# Altium schematic sheet OMD_F3_MCU.SchDoc
size A2; Organization: Altium Limited; Address1: L3, 12a Rodborough Rd; Address2: Frenchs Forest; Address3: NSW; Address4: Australia 2086
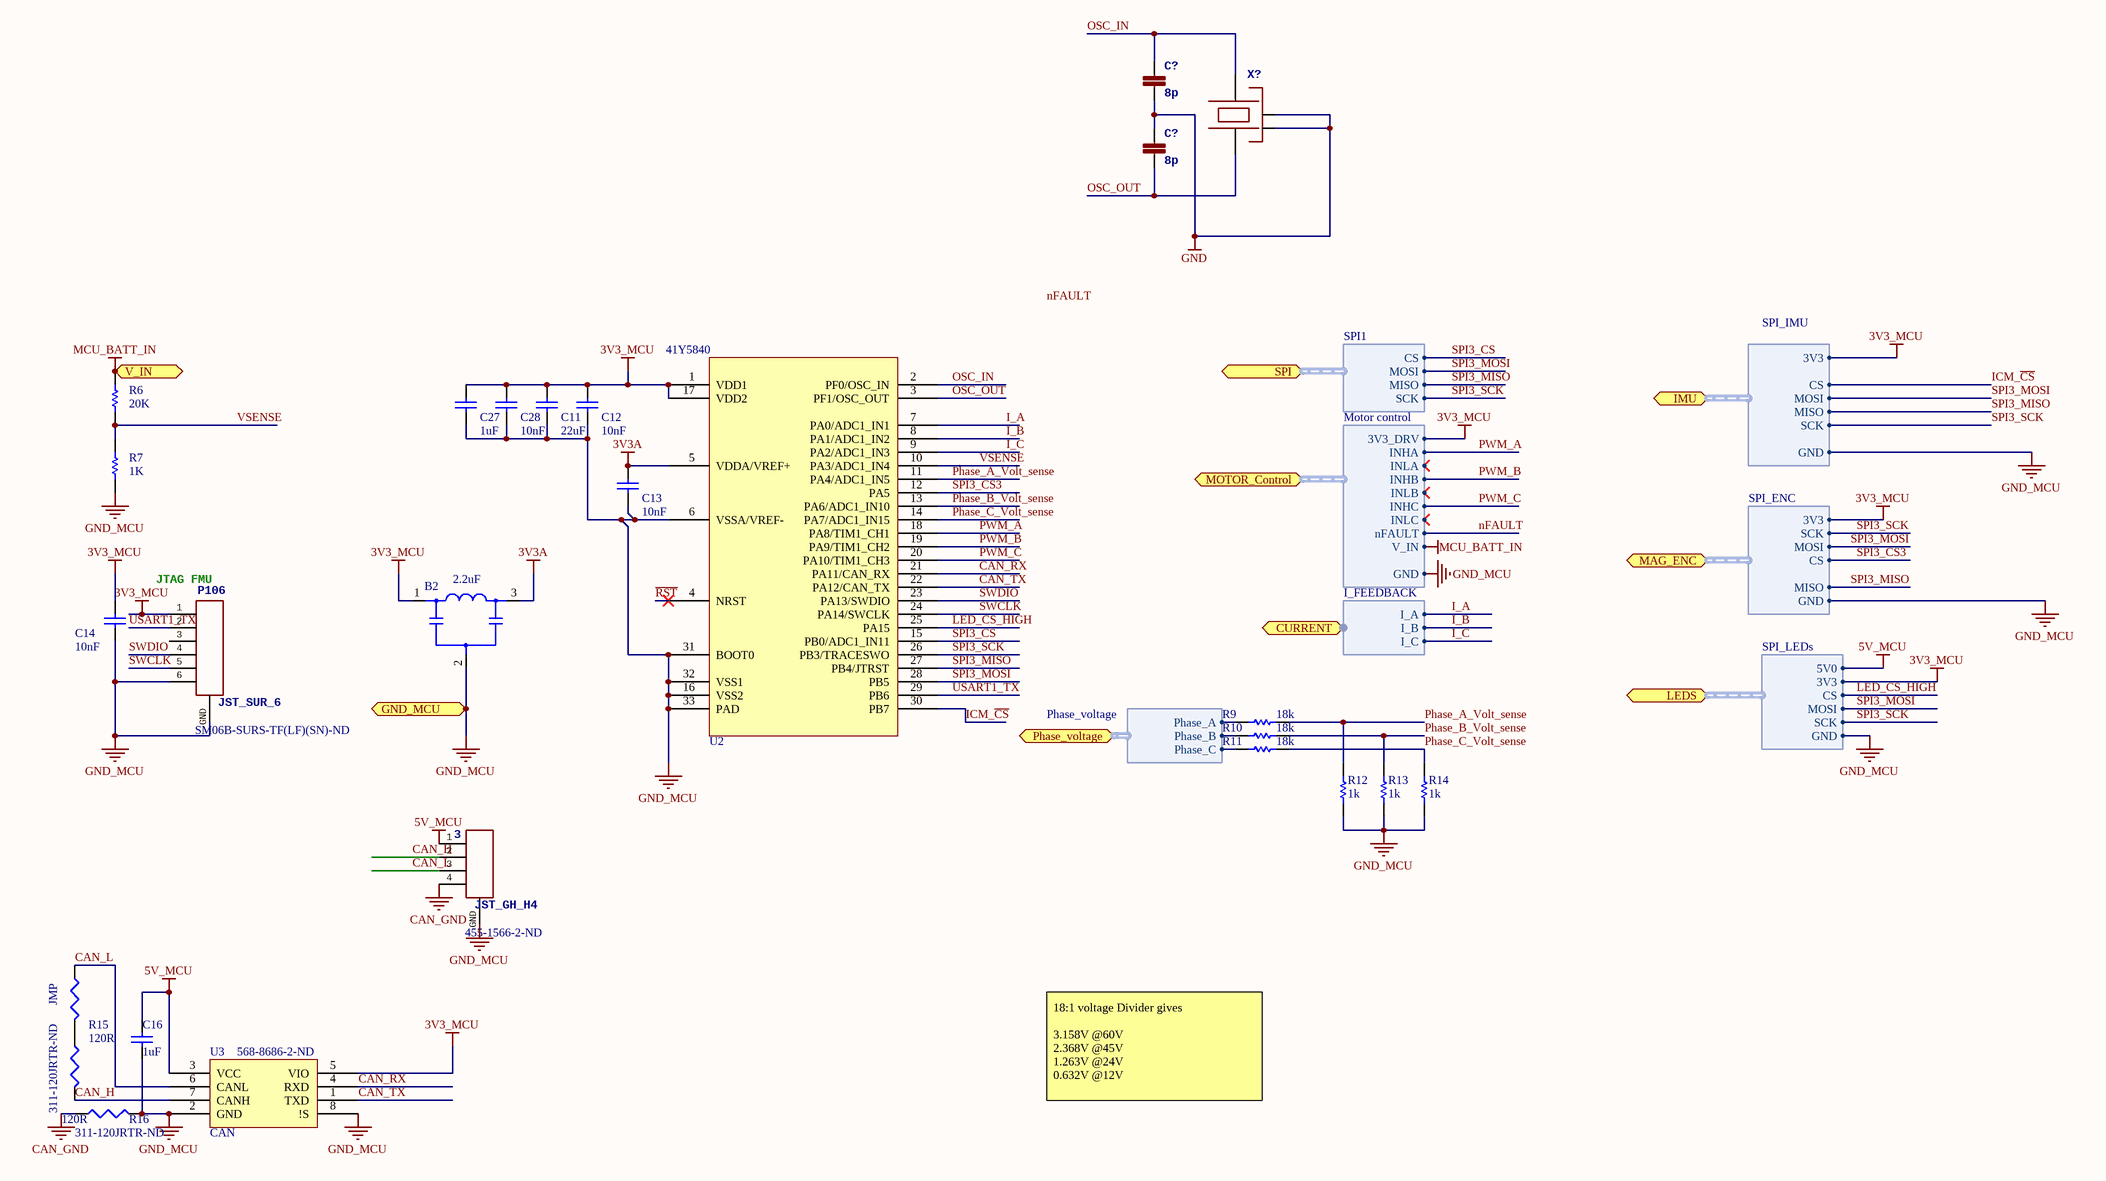
[diagram p0: OMD_F3_MCU.SchDoc]

## Parts
(Parts that share a designator on the sheet are numbered #1, #2 ... from top to bottom, then left to right.)
3  JST_GH_H4  Supplier Part Number 1: 455-1566-2-ND  [JST_GH_H4]
B2  value 2.2uF  [NFM18CC]  (hidden comment: Filter)
C11  value 22uF  [CAPC2012L]  (hidden comment: Cap)
C12  value 10nF  [CAPC1005L]  (hidden comment: CAP CER 10000PF 50V X7R 0402)
C13  value 10nF  [CAPC1005L]  (hidden comment: CAP CER 10000PF 50V X7R 0402)
C14  value 10nF  [CAPC1005L]  (hidden comment: CAP CER 10000PF 50V X7R 0402)
C16  value 1uF  [CAPC1005L]  (hidden comment: Cap)
C27  value 1uF  [CAPC1005L]  (hidden comment: Cap)
C28  value 10nF  [CAPC1005L]  (hidden comment: CAP CER 10000PF 50V X7R 0402)
C?#1  8p  [0201-cap]
C?#2  8p  [0201-cap]
JMP  solder  [R0402]  (value not drawn)  (no BOM)
P106  JST_SUR_6  Supplier Part Number 1: SM06B-SURS-TF(LF)(SN)-ND  [JST_SUR_H6]
R6  value 20K  [RESC1005L]  (hidden comment: CRCW040220K0FKED)
R7  value 1K  [RESC1005L]  (hidden comment: CRCW04021K00FKED)
R9  value 18k  [R0805]  (hidden comment: RES)
R10  value 18k  [R0805]  (hidden comment: RES)
R11  value 18k  [R0805]  (hidden comment: RES)
R12  value 1k  [R0805]  (hidden comment: RES)
R13  value 1k  [R0805]  (hidden comment: RES)
R14  value 1k  [R0805]  (hidden comment: RES)
R15  value 120R  Supplier Part Number 1: 311-120JRTR-ND  [R0402]  (hidden comment: RES SMD 120 OHM 5% 1/16W 0402)
R16  value 120R  Supplier Part Number 1: 311-120JRTR-ND  [R0402]  (hidden comment: RES SMD 120 OHM 5% 1/16W 0402)
U2  Supplier Part Number 1: 41Y5840  [QFN50P500X500X60-32L]  (hidden comment: IC MCU M4 64KB FLASH 32UFQFPN)
U3  CAN  Supplier Part Number 1: 568-8686-2-ND  [SON65P300X100_HS-9N]
X?  Crystal Oscillator in SMD 1.6 x 1.2  [OSCILLATOR-1.6x1.2]  (value not drawn)

## Ports
CURRENT (harness I_FEEDBACK), GND_MCU, IMU (harness SPI_IMU), LEDS (harness SPI_LEDs), MAG_ENC (harness SPI_ENC), MOTOR_Control (harness Motor control), Phase_voltage (harness Phase_voltage), SPI (harness SPI1), V_IN

## Harnesses
Motor control: 3V3_DRV, INHA, INLA, INHB, INLB, INHC, INLC, nFAULT, V_IN, GND
I_FEEDBACK: I_A, I_B, I_C
Phase_voltage: Phase_A, Phase_B, Phase_C
SPI1: SCK, MISO, MOSI, CS
SPI_IMU: SCK, MISO, MOSI, CS, 3V3, GND
SPI_ENC: SCK, MISO, MOSI, CS, 3V3, GND
SPI_LEDs: SCK, MOSI, CS, 3V3, 5V0, GND

## Nets
3V3_MCU: B2.1(IN) C11.2 C12.2 C14.2 C27.1 C28.2 P106.1 U2.1(VDD1) U2.17(VDD2) U3.5(VIO) ; port MOTOR_Control.3V3_DRV, port IMU.3V3, port MAG_ENC.3V3, port LEDS.3V3
3V3A: B2.3(OUT) C13.2 U2.5(VDDA/VREF+)
5V_MCU: 3.1 C16.2 U3.3(VCC) ; port LEDS.5V0
CAN_GND: 3.4 R16.1
GND: C?#1.2 C?#2.1 X?.2(NC_2) X?.4(NC_4)
GND_MCU: 3.GND B2.2(GND) C11.1 C12.1 C13.1 C14.1 C16.1 C27.2 C28.1 P106.6 P106.GND R7.2 R12.2 R13.2 R14.2 R16.2 U2.6(VSSA/VREF-) U2.16(VSS2) U2.31(BOOT0) U2.32(VSS1) U2.33(PAD) U3.2(GND) U3.8(!S) ; port GND_MCU, port MOTOR_Control.GND, port IMU.GND, port MAG_ENC.GND, port LEDS.GND
MCU_BATT_IN: R6.2 ; port V_IN, port MOTOR_Control.V_IN
CAN_H: 3.2 R15.2 U3.7(CANH)
CAN_L: 3.3 JMP.1 U3.6(CANL)
CAN_RX: U2.21(PA11/CAN_RX) U3.4(RXD)
CAN_TX: U2.22(PA12/CAN_TX) U3.1(TXD)
I_A: U2.7(PA0/ADC1_IN1) ; port CURRENT.I_A
I_B: U2.8(PA1/ADC1_IN2) ; port CURRENT.I_B
I_C: U2.9(PA2/ADC1_IN3) ; port CURRENT.I_C
ICM_~{CS}: U2.30(PB7) ; port IMU.CS
LED_CS_HIGH: U2.25(PA15) ; port LEDS.CS
nFAULT: port MOTOR_Control.nFAULT
OSC_IN: C?#1.1 U2.2(PF0/OSC_IN) X?.3
OSC_OUT: C?#2.2 U2.3(PF1/OSC_OUT) X?.1
Phase_A_Volt_sense: R9.2 R12.1 U2.11(PA4/ADC1_IN5)
Phase_B_Volt_sense: R10.2 R13.1 U2.13(PA6/ADC1_IN10)
Phase_C_Volt_sense: R11.2 R14.1 U2.14(PA7/ADC1_IN15)
PWM_A: U2.18(PA8/TIM1_CH1) ; port MOTOR_Control.INHA
PWM_B: U2.19(PA9/TIM1_CH2) ; port MOTOR_Control.INHB
PWM_C: U2.20(PA10/TIM1_CH3) ; port MOTOR_Control.INHC
~{RST}: U2.4(NRST)
SPI3_CS: U2.15(PB0/ADC1_IN11) ; port SPI.CS
SPI3_CS3: U2.12(PA5) ; port MAG_ENC.CS
SPI3_MISO: U2.27(PB4/JTRST) ; port SPI.MISO, port IMU.MISO, port MAG_ENC.MISO
SPI3_MOSI: U2.28(PB5) ; port SPI.MOSI, port IMU.MOSI, port MAG_ENC.MOSI, port LEDS.MOSI
SPI3_SCK: U2.26(PB3/TRACESWO) ; port SPI.SCK, port IMU.SCK, port MAG_ENC.SCK, port LEDS.SCK
SWCLK: P106.5 U2.24(PA14/SWCLK)
SWDIO: P106.4 U2.23(PA13/SWDIO)
USART1_TX: P106.2 U2.29(PB6)
VSENSE: R6.1 R7.1 U2.10(PA3/ADC1_IN4)
NetJMP_2: JMP.2 R15.1
NetR9_1: R9.1 ; port Phase_voltage.Phase_A
NetR10_1: R10.1 ; port Phase_voltage.Phase_B
NetR11_1: R11.1 ; port Phase_voltage.Phase_C

Not connected (* = marked no-connect by the designer): P106 3

## Notes on the sheet
- (near P106) JTAG FMU
- 18:1 voltage Divider gives
  3.158V @60V
  2.368V @45V
  1.263V @24V
  0.632V @12V
  worst case is 3S, which could risk noise that is unacceptable.
  Testing will determine this.
  it may require that we do a 3-8s, and an 8-10s version, with different resistors.
  This only affects Closed loop control, no effect on FOC
- Labels drawn without touching a wire or pin: nFAULT
- https://github.com/OpenMotorDrive
- Title
- ProfiCNC Pty. Ltd.
- https://creativecommons.org/licenses/by-nc-sa/4.0/
- For Commercial use, please contact ProfiCNC
- ProfiCNC does NOT guaranty these drawings as fit for any purpose, you must verify this information before attempting to use it in any way.  USE AT OWN RISK
- Size:
- Date:
- File:
- A2
- Number:
- Time:
- Revision:
- Sheet
- of

## Library data of the parts
3 = JST_GH_H4: SM04B-GHS-TB; Supplier 1: Digi-Key
B2 = NFM18CC222R1C3: EMIFIL (Capacitor type) Single Circuit Type for Signal Lines; Supplier 1: Digi-Key; Supplier Part Number 1: 490-6972-1-ND
C11 = Cap: Capacitor; Supplier 1: Digi-Key; Supplier Part Number 1: 587-3391-1-ND
C12-C14 C28 = Cap: Supplier 1: Digi-Key; Supplier Part Number 1: 445-6893-1-ND
C16 C27 = Cap: CAP CER 1UF 6.3V X5R 0402; Supplier 1: Digi-Key; Supplier Part Number 1: 587-3766-1-ND
C?#1 C?#2 = CAP0402: CAP CER 8PF 50V NP0 0201; Supplier 1: Digi-Key; Supplier Part Number 1: 490-13331-1-ND
JMP R15 R16 = Resistor
  R15 R16: Supplier 1: Digi-Key
P106 = JST_SUR_6: Connector, Header, 6Pos, .8mm IDC, R/A, SMD, Tin; Supplier 1: Digi-Key
R6 R7 = Res1: Supplier 1: Digi-Key
  R6: Supplier Part Number 1: 541-20.0KLCT-ND
  R7: Supplier Part Number 1: 541-1.00KLCT-ND
R9-R11 = R00155: RES SMD 18K OHM 1% 1/8W 0805; Supplier 1: Digi-Key; Supplier Part Number 1: 311-18.0KCRCT-ND
R12-R14 = R00095: RES SMD 1K OHM 1% 1/8W 0805; Supplier 1: Digi-Key; Supplier Part Number 1: 311-1.00KCRCT-ND
U2 = STM32F302K8U6: 72 MHz Cortex-M4F MCU with 16 KB RAM, 64 KB flash; Supplier 1: Newark
X? = OSCILLATOR-3.2X2.5: CRYSTAL 24MHZ 8PF SMD; Supplier 1: Digi-Key; Supplier Part Number 1: 887-1846-2-ND
U3 = CAN: Supplier 1: Digi-Key